# Altium schematic sheet AVR Board 4.0 Master Sheet.SchDoc
size A
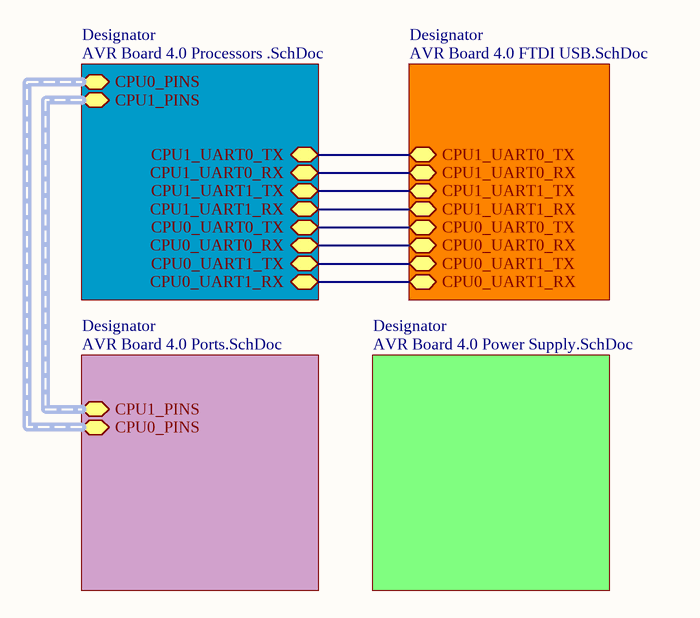
[diagram p0: AVR Board 4.0 Master Sheet.SchDoc]

## Sub-sheets
Designator = AVR Board 4.0 Processors .SchDoc: CPU1_PINS (harness CPU1_PORTS), CPU0_PINS (harness CPU0_PORTS), CPU1_UART0_TX, CPU1_UART0_RX, CPU1_UART1_TX, CPU1_UART1_RX, CPU0_UART0_TX, CPU0_UART0_RX, CPU0_UART1_TX, CPU0_UART1_RX
Designator = AVR Board 4.0 FTDI USB.SchDoc: CPU1_UART0_TX, CPU1_UART0_RX, CPU1_UART1_TX, CPU1_UART1_RX, CPU0_UART0_TX, CPU0_UART0_RX, CPU0_UART1_TX, CPU0_UART1_RX
Designator = AVR Board 4.0 Ports.SchDoc: CPU1_PINS (harness CPU1_PORTS), CPU0_PINS (harness CPU0_PORTS)
Designator = AVR Board 4.0 Power Supply.SchDoc: no entries

## Nets
(unnamed): sheet Designator/CPU1_UART0_TX, sheet Designator/CPU1_UART0_TX
(unnamed): sheet Designator/CPU1_UART0_RX, sheet Designator/CPU1_UART0_RX
(unnamed): sheet Designator/CPU1_UART1_TX, sheet Designator/CPU1_UART1_TX
(unnamed): sheet Designator/CPU1_UART1_RX, sheet Designator/CPU1_UART1_RX
(unnamed): sheet Designator/CPU0_UART0_TX, sheet Designator/CPU0_UART0_TX
(unnamed): sheet Designator/CPU0_UART0_RX, sheet Designator/CPU0_UART0_RX
(unnamed): sheet Designator/CPU0_UART1_TX, sheet Designator/CPU0_UART1_TX
(unnamed): sheet Designator/CPU0_UART1_RX, sheet Designator/CPU0_UART1_RX